# EasyEDA schematic SCH_280049主控制板.json
TITLE: Sheet_1; REV: 1.0; Date: 2020-03-19; Sheet: 1/1; Drawn By: paking_zhang; Company: Your Company
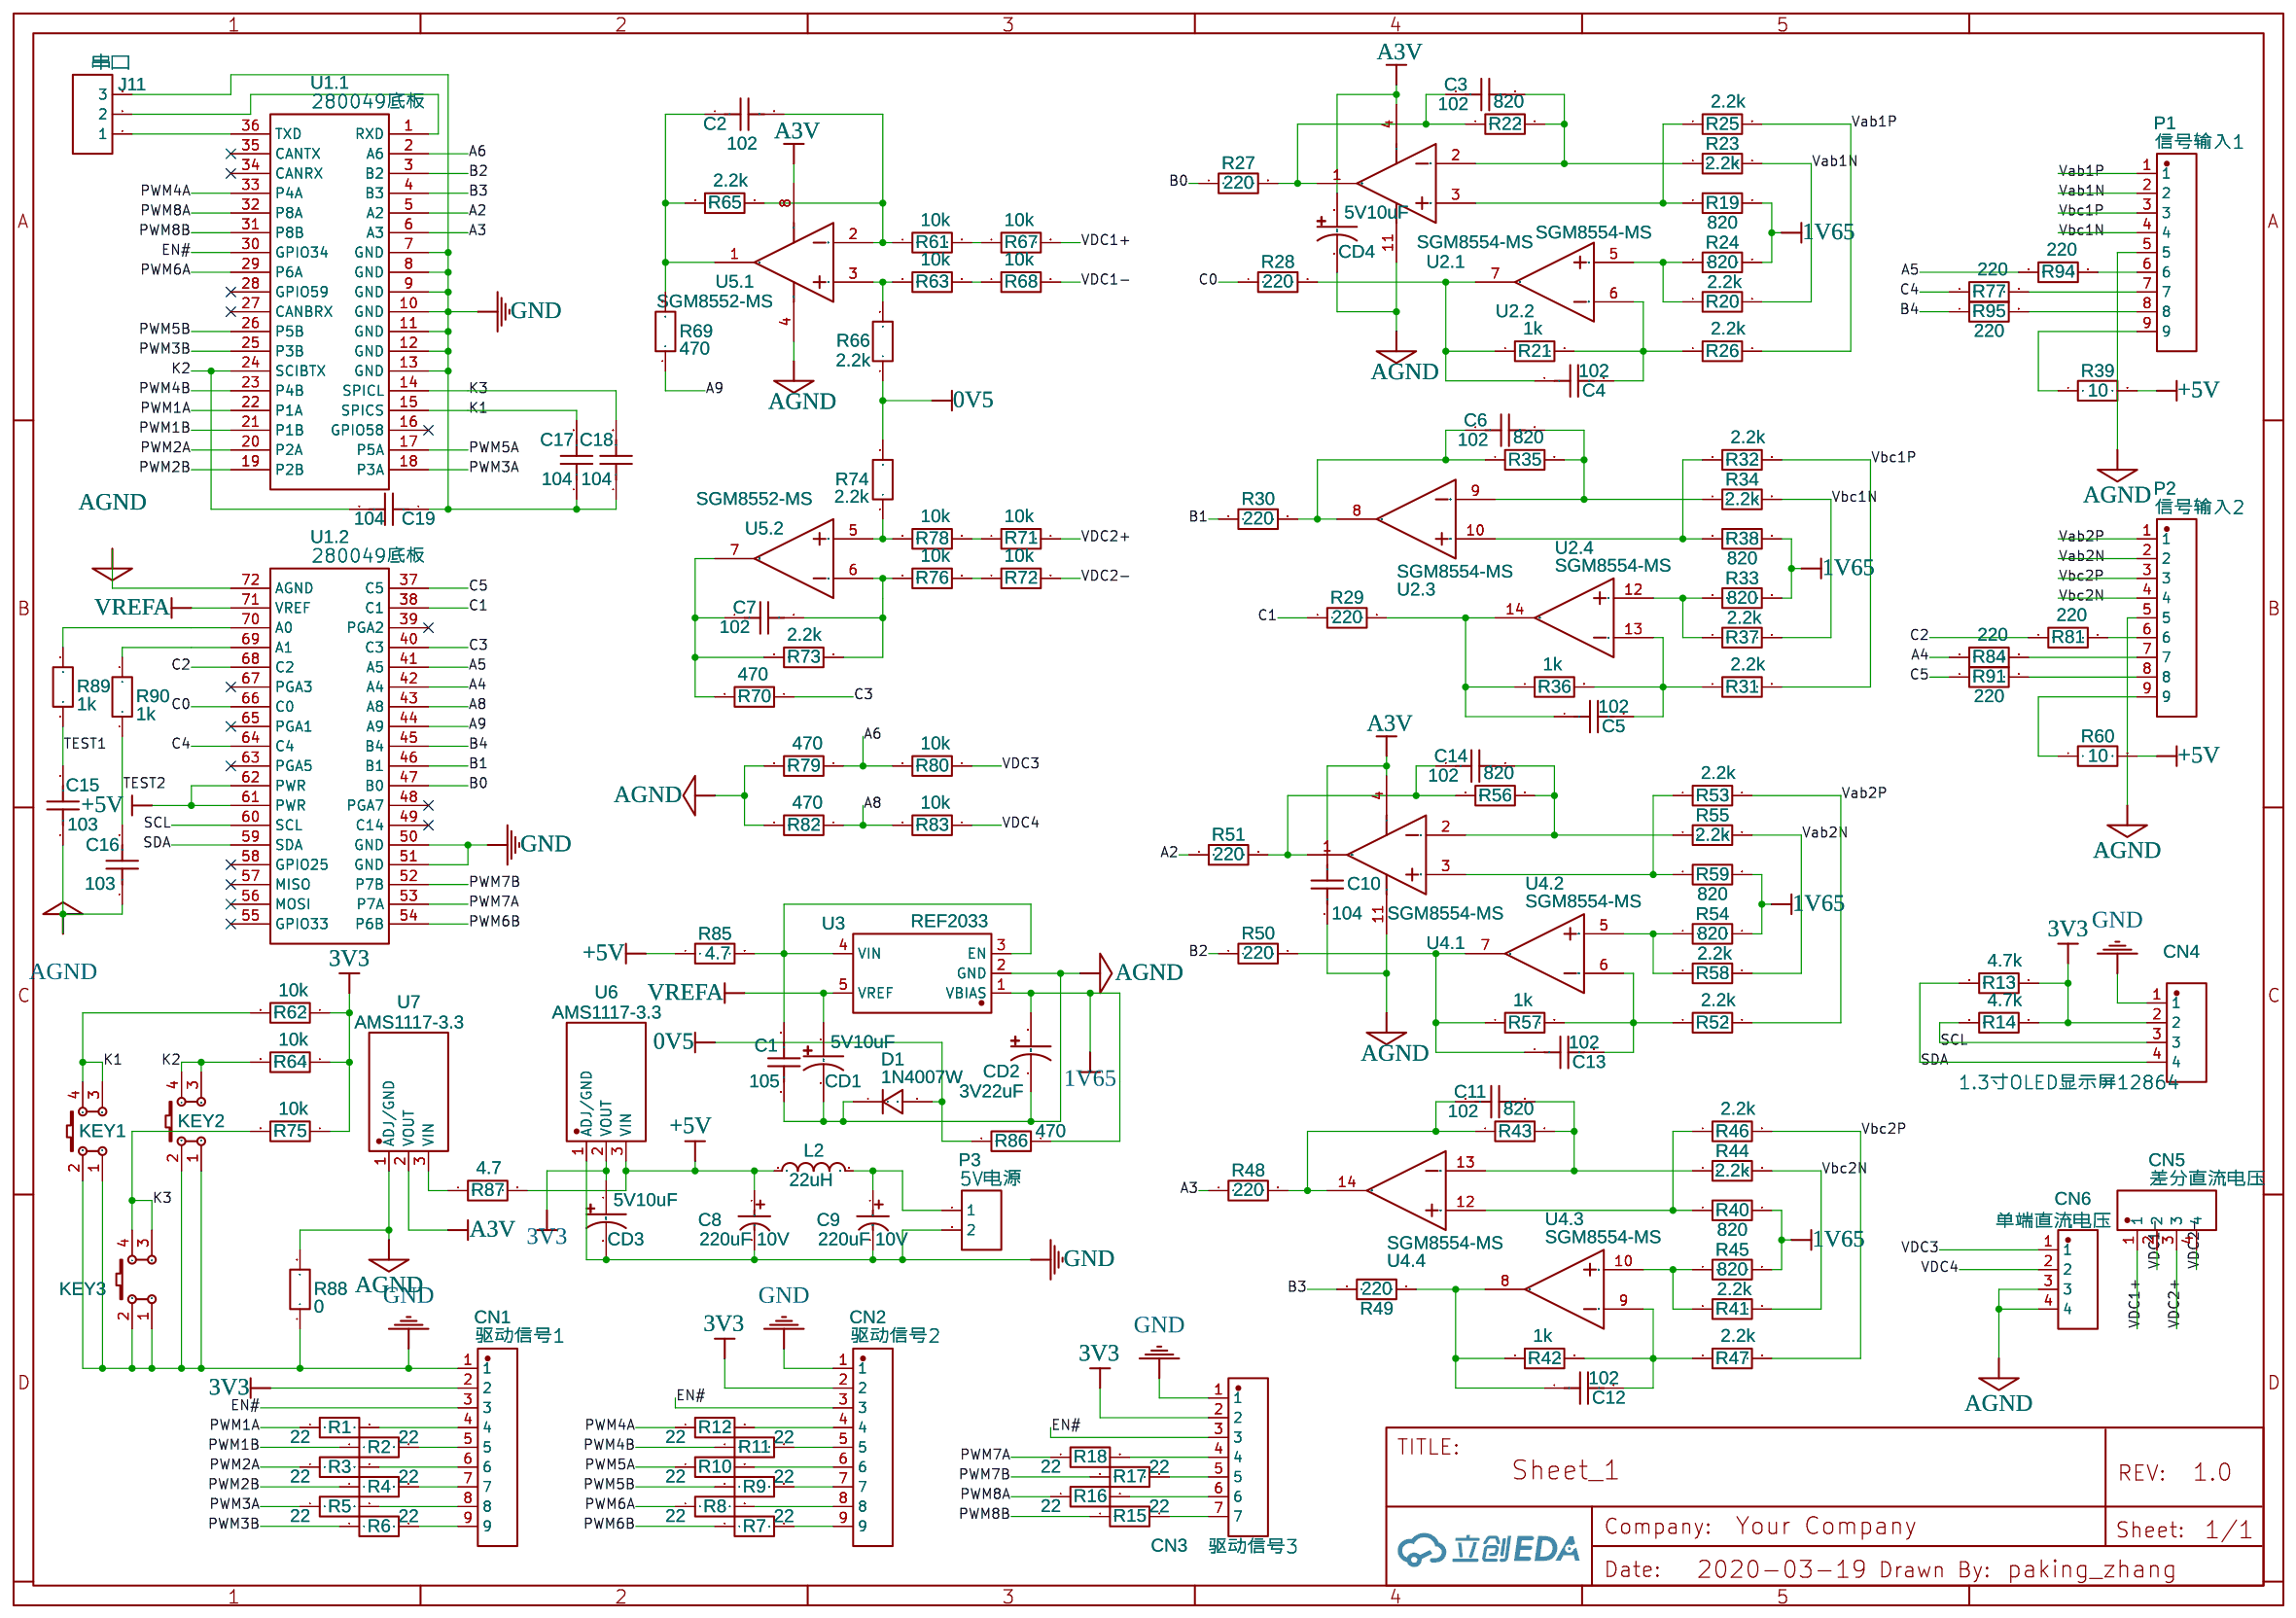
[diagram p0: schematic sheet]

## Parts
C1  105  [C0805]
C2  102  [C0805]
C3  102  [C0805]
C4  102  [C0805]
C5  102  [C0805]
C6  102  [C0805]
C7  102  [C0805]
C8  220uF 10V  [CAP-SMD_BD6.3-L6.6-W6.6-LS7.2-FD]
C9  220uF 10V  [CAP-SMD_BD6.3-L6.6-W6.6-LS7.2-FD]
C10  104  [C0805]
C11  102  [C0805]
C12  102  [C0805]
C13  102  [C0805]
C14  102  [C0805]
C15  103  [C0805]
C16  103  [C0805]
C17  104  [C0805]
C18  104  [C0805]
C19  104  [C0805]
CD1  5V10uF  [CAP-SMD_L3.2-W1.6]
CD2  3V22uF  [CAP-SMD_L3.2-W1.6]
CD3  5V10uF  [CAP-SMD_L3.2-W1.6]
CD4  5V10uF  [CAP-SMD_L3.2-W1.6]
CN1  驱动信号1  [CONN-TH_9P-P2.50_BX-XH2.54-9PZZ]
CN2  驱动信号2  [CONN-TH_9P-P2.50_BX-XH2.54-9PZZ]
CN3  驱动信号3  [CONN-TH_XH2.54-7P]
CN4  1.3寸OLED显示屏12864  [OLED-TH12864]
CN5  差分直流电压  [CONN-TH_XH2.54-4]
CN6  单端直流电压  [CONN-TH_XH2.54-4]
D1  1N4007W  [SOD-123_L2.8-W1.8-LS3.7-RD]
J11  串口  [HDR-M-2.54_1X3]
KEY1  K4-6×6_TH  [KEY-TH_4P-L6.0-W6.0-P4.50-LS6.5]
KEY2  K4-6×6_TH  [KEY-TH_4P-L6.0-W6.0-P4.50-LS6.5]
KEY3  K4-6×6_TH  [KEY-TH_4P-L6.0-W6.0-P4.50-LS6.5]
L2  22uH  [IND-SMD_L4.0-W4.0]
P1  信号输入1  [CONN-TH_XH2.54-9A]
P2  信号输入2  [CONN-TH_XH2.54-9A]
P3  5V电源  [CONN-TH_2P-P5.08]
R1  22  [R0805]
R2  22  [R0805]
R3  22  [R0805]
R4  22  [R0805]
R5  22  [R0805]
R6  22  [R0805]
R7  22  [R0805]
R8  22  [R0805]
R9  22  [R0805]
R10  22  [R_AXIAL-0.5]
R11  22  [R0805]
R12  22  [R0805]
R13  4.7k  [R0805]
R14  4.7k  [R0805]
R15  22  [R_AXIAL-0.4]
R16  22  [R_AXIAL-0.4]
R17  22  [R0805]
R18  22  [R0805]
R19  820  [R0805]
R20  2.2k  [R0805]
R21  1k  [R0805]
R22  820  [R0805]
R23  2.2k  [R0805]
R24  820  [R0805]
R25  2.2k  [R0805]
R26  2.2k  [R0805]
R27  220  [R_AXIAL-0.4]
R28  220  [R_AXIAL-0.4]
R29  220  [R_AXIAL-0.4]
R30  220  [R_AXIAL-0.4]
R31  2.2k  [R_AXIAL-0.4]
R32  2.2k  [R_AXIAL-0.4]
R33  820  [R0805]
R34  2.2k  [R_AXIAL-0.4]
R35  820  [R0805]
R36  1k  [R0805]
R37  2.2k  [R_AXIAL-0.4]
R38  820  [R0805]
R39  10  [R0805]
R40  820  [R0805]
R41  2.2k  [R0805]
R42  1k  [R0805]
R43  820  [R0805]
R44  2.2k  [R0805]
R45  820  [R0805]
R46  2.2k  [R0805]
R47  2.2k  [R0805]
R48  220  [R0805]
R49  220  [R0805]
R50  220  [R0805]
R51  220  [R0805]
R52  2.2k  [R0805]
R53  2.2k  [R0805]
R54  820  [R0805]
R55  2.2k  [R0805]
R56  820  [R0805]
R57  1k  [R0805]
R58  2.2k  [R0805]
R59  820  [R0805]
R60  10  [R0805]
R61  10k  [R0805]
R62  10k  [R0805]
R63  10k  [R0805]
R64  10k  [R0805]
R65  2.2k  [R0805]
R66  2.2k  [R0805]
R67  10k  [R0805]
R68  10k  [R0805]
R69  470  [R0805]
R70  470  [R0805]
R71  10k  [R0805]
R72  10k  [R0805]
R73  2.2k  [R0805]
R74  2.2k  [R0805]
R75  10k  [R0805]
R76  10k  [R0805]
R77  220  [R_AXIAL-0.4]
R78  10k  [R0805]
R79  470  [R0805]
R80  10k  [R_AXIAL-0.4]
R81  220  [R0805]
R82  470  [R0805]
R83  10k  [R_AXIAL-0.4]
R84  220  [R0805]
R85  4.7  [R0805]
R86  470  [R0805]
R87  4.7  [R0805]
R88  0  [R0805]
R89  1k  [R_AXIAL-0.4]
R90  1k  [R_AXIAL-0.4]
R91  220  [R_AXIAL-0.4]
R94  220  [R_AXIAL-0.4]
R95  220  [R_AXIAL-0.4]
U1  280049底板  [280049底板]  (sections 1,2)
U2  SGM8554-MS  [SOIC-14_L8.6-W3.8-P1.27-LS6.0-BL]  (sections 1,2,3,4)
U3  REF2033  [SOT-23-5_L3.0-W1.7-P0.95-LS2.8-BL]
U4  SGM8554-MS  [SOIC-14_L8.6-W3.8-P1.27-LS6.0-BL]  (sections 1,2,3,4)
U5  SGM8552-MS  [SOIC-8_L5.0-W4.0-P1.27-LS6.1-BL]  (sections 1,2)
U6  AMS1117-3.3  [SOT-89-3_L4.5-W2.5-P1.50-LS4.2-BR]
U7  AMS1117-3.3  [SOT-89-3_L4.5-W2.5-P1.50-LS4.2-BR]

## Library data of the parts
C1 C2 C7 C10 C15 C16 = C_0805_US: Contributor: LCEDA_Lib
C3-C6 C11-C14 = C_0603_US: Contributor: LCEDA_Lib
C8 C9 = 固态电容220UF/10V6.3*5.4: Contributor: LCSC; Supplier: LCSC; Supplier Part: C9900001736; Manufacturer Part: 固态电容220uF/10V6.3*5.4; JLCPCB Part Class: Extended Part; Manufacturer: null
C17-C19 = C_RAD-0.2_US: Contributor: LCEDA_Lib
CD1-CD4 = 5V10UF钽电容-3528: Contributor: LCSC; Supplier: LCSC; Supplier Part: C9900010526; Manufacturer: null; Manufacturer Part: 5v10uf钽电容-3528
CN1 CN2 = BX-XH2.54-9PZZ: Supplier: LCSC; Supplier Part: C18077840; Manufacturer: Bossie(博锡); Contributor: lcsc; JLCPCB Part Class: Extended Part
CN3 = XH2.54-7P 直插: Contributor: LCSC; Supplier: LCSC; Supplier Part: C9900000729; Manufacturer: null; JLCPCB Part Class: Extended Part
CN4 = 1.3寸OLED显示屏12864: Contributor: lcsc; Supplier: LCSC; Supplier Part: C9900014198; Manufacturer: null; JLCPCB Part Class: Extended Part
CN5 CN6 = XH2.54-4PIN: Contributor: lcsc; Supplier: LCSC; Supplier Part: C9900014913; Manufacturer: null; JLCPCB Part Class: Extended Part
D1 = 1N4007W: Supplier: LCSC; Supplier Part: C328592; Manufacturer: BLUE ROCKET; Contributor: LCEDA_Lib
J11 = HDR-M-2.54_1x3: Supplier Part: C180248; Supplier: LCSC; Contributor: LCEDA_Lib
KEY1-KEY3 = K4-6×6_TH: Supplier: LCSC; Supplier Part: C136684; Manufacturer: 韩国韩荣; Manufacturer Part: K2-1102DP-E4SW-04; Contributor: LCEDA_Lib
L2 = ASPIAIG-S4035-2R2M-T: Supplier: LCSC; Supplier Part: C7217583; Manufacturer: ABRACON; Contributor: lcsc; JLCPCB Part Class: Extended Part
P1 P2 = BX-XH2.54-9PWZ: Supplier: LCSC; Supplier Part: C18077849; Manufacturer: Bossie(博锡); Contributor: lcsc; JLCPCB Part Class: Extended Part
P3 = CONN-TH_2P-P5.08: Supplier: LCSC; Contributor: LCEDA_Lib
R1-R91 R94 R95 = R_0805_EU: Contributor: LCEDA_Lib
U1 = 28069底板: Contributor: Qu♂; subpart_no: 1
U2 U4 = SGM8554-MS: Supplier: LCSC; Supplier Part: C22462540; Manufacturer: null; JLCPCB Part Class: Extended Part; subpart_no: 1
U3 = REF2033AIDDCR: Contributor: LCSC; Supplier: LCSC; Supplier Part: C440747; Manufacturer: TI(德州仪器); JLCPCB Part Class: Extended Part
U5 = SGM8552-MS: Supplier: LCSC; Supplier Part: C22462535; Manufacturer: null; JLCPCB Part Class: Extended Part; subpart_no: 1
U6 U7 = AMS1117-5.0V: Supplier: LCSC; Supplier Part: C7473143; Manufacturer: MSKSEMI(美森科); Contributor: lcsc; JLCPCB Part Class: Extended Part

## Nets
0V5: D1.2 R66.1 R74.2 R86.2
1V65: CD2.1 R19.2 R24.2 R33.2 R38.2 R40.2 R45.2 R54.2 R59.2 R86.1 U3.1(VBIAS)
3V3: CD3.1 CN1.2 CN2.2 CN3.2 CN4.2 R13.1 R14.1 R62.1 R64.1 R75.1 U6.2(VOUT)
+5V: C8.1 L2.1 R39.2 R60.2 R85.1 R87.2 U1.61(PWR) U1.62(PWR) U6.3(VIN)
A3V: C10.2 CD4.1 U2.4(V+) U4.4(V+) U5.8(V+) U7.2(VOUT)
AGND: C1.1 C10.1 C15.1 C16.1 CD1.2 CD2.2 CD4.2 CN6.3 CN6.4 D1.1 P1.5 P2.5 R79.2 R82.2 R88.2 U1.72(AGND) U2.11(V-) U3.2(GND) U4.11(V-) U5.4(GND) U7.1(ADJ/GND)
GND: C8.2 C9.2 C17.1 C18.1 C19.1 CD3.2 CN1.1 CN2.1 CN3.1 CN4.1 J11.3 KEY1.1 KEY1.2 KEY2.1 KEY2.2 KEY3.1 KEY3.2 P3.2 R88.1 U1.7(GND) U1.8(GND) U1.9(GND) U1.10(GND) U1.11(GND) U1.12(GND) U1.13(GND) U1.50(GND) U1.51(GND) U6.1(ADJ/GND)
A2: R51.1 U1.5(A2)
A3: R48.1 U1.6(A3)
A4: R84.1 U1.42(A4)
A5: R94.1 U1.41(A5)
A6: R79.1 R80.2 U1.2(A6)
A8: R82.1 R83.2 U1.43(A8)
A9: R69.1 U1.44(A9)
B0: R27.1 U1.47(B0)
B1: R30.1 U1.46(B1)
B2: R50.1 U1.3(B2)
B3: R49.1 U1.4(B3)
B4: R95.1 U1.45(B4)
C0: R28.1 U1.66(C0)
C1: R29.1 U1.38(C1)
C2: R81.1 U1.68(C2)
C3: R70.1 U1.40(C3)
C4: R77.1 U1.64(C4)
C5: R91.1 U1.37(C5)
EN#: CN1.3 CN2.3 CN3.3 U1.30(GPIO34)
K1: C17.2 KEY1.3 KEY1.4 R62.2 U1.15(SPICS)
K2: C19.2 KEY2.3 KEY2.4 R64.2 U1.24(SCIBTX)
K3: C18.2 KEY3.3 KEY3.4 R75.2 U1.14(SPICL)
PWM1A: R1.1 U1.22(P1A)
PWM1B: R2.1 U1.21(P1B)
PWM2A: R3.1 U1.20(P2A)
PWM2B: R4.1 U1.19(P2B)
PWM3A: R5.1 U1.18(P3A)
PWM3B: R6.1 U1.25(P3B)
PWM4A: R12.1 U1.33(P4A)
PWM4B: R11.1 U1.23(P4B)
PWM5A: R10.1 U1.17(P5A)
PWM5B: R9.1 U1.26(P5B)
PWM6A: R8.1 U1.29(P6A)
PWM6B: R7.1 U1.54(P6B)
PWM7A: R18.1 U1.53(P7A)
PWM7B: R17.1 U1.52(P7B)
PWM8A: R16.1 U1.32(P8A)
PWM8B: R15.1 U1.31(P8B)
SCL: CN4.3 R14.2 U1.60(SCL)
SDA: CN4.4 R13.2 U1.59(SDA)
TEST1: C15.2 R89.1
TEST2: C16.2 R90.1
Vab1N: P1.2 R20.2 R23.2
Vab1P: P1.1 R25.2 R26.2
Vab2N: P2.2 R55.2 R58.2
Vab2P: P2.1 R52.2 R53.2
Vbc1N: P1.4 R34.2 R37.2
Vbc1P: P1.3 R31.2 R32.2
Vbc2N: P2.4 R41.2 R44.2
Vbc2P: P2.3 R46.2 R47.2
VDC1+: CN5.1 R67.2
VDC1-: CN5.2 R68.2
VDC2+: CN5.3 R72.2
VDC2-: CN5.4 R71.2
VDC3: CN6.1 R80.1
VDC4: CN6.2 R83.1
VREFA: CD1.1 U1.71(VREF) U3.5(VREF)
Net-(C1-2): C1.2 R85.2 U3.3(EN) U3.4(VIN)
Net-(C2-1): C2.1 R65.1 R69.2 U5.1(OUTA)
Net-(C2-2): C2.2 R61.1 R65.2 U5.2(INA-)
Net-(C3-1): C3.1 R22.1 R27.2 U2.1(1OUT)
Net-(C3-2): C3.2 R22.2 R23.1 U2.2(1IN−)
Net-(C4-1): C4.1 R21.1 R28.2 U2.7(2OUT)
Net-(C4-2): C4.2 R21.2 R26.1 U2.6(2IN−)
Net-(C5-1): C5.1 R29.2 R36.1 U2.14(4OUT)
Net-(C5-2): C5.2 R31.1 R36.2 U2.13(4IN−)
Net-(C6-1): C6.1 R30.2 R35.1 U2.8(3OUT)
Net-(C6-2): C6.2 R34.1 R35.2 U2.9(3IN−)
Net-(C7-1): C7.1 R70.2 R73.2 U5.7(OUTB)
Net-(C7-2): C7.2 R73.1 R76.1 U5.6(INB-)
Net-(C9-1): C9.1 L2.2 P3.1
Net-(C11-1): C11.1 R43.1 R48.2 U4.14(4OUT)
Net-(C11-2): C11.2 R43.2 R44.1 U4.13(4IN−)
Net-(C12-1): C12.1 R42.1 R49.2 U4.8(3OUT)
Net-(C12-2): C12.2 R42.2 R47.1 U4.9(3IN−)
Net-(C13-1): C13.1 R50.2 R57.1 U4.7(2OUT)
Net-(C13-2): C13.2 R52.1 R57.2 U4.6(2IN−)
Net-(C14-1): C14.1 R51.2 R56.1 U4.1(1OUT)
Net-(C14-2): C14.2 R55.1 R56.2 U4.2(1IN−)
Net-(CN1-4): CN1.4 R1.2
Net-(CN1-5): CN1.5 R2.2
Net-(CN1-6): CN1.6 R3.2
Net-(CN1-7): CN1.7 R4.2
Net-(CN1-8): CN1.8 R5.2
Net-(CN1-9): CN1.9 R6.2
Net-(CN2-4): CN2.4 R12.2
Net-(CN2-5): CN2.5 R11.2
Net-(CN2-6): CN2.6 R10.2
Net-(CN2-7): CN2.7 R9.2
Net-(CN2-8): CN2.8 R8.2
Net-(CN2-9): CN2.9 R7.2
Net-(CN3-4): CN3.4 R18.2
Net-(CN3-5): CN3.5 R17.2
Net-(CN3-6): CN3.6 R16.2
Net-(CN3-7): CN3.7 R15.2
Net-(J11-1): J11.1 U1.36(TXD)
Net-(J11-2): J11.2 U1.1(RXD)
Net-(P1-6): P1.6 R94.2
Net-(P1-7): P1.7 R77.2
Net-(P1-8): P1.8 R95.2
Net-(P1-9): P1.9 R39.1
Net-(P2-6): P2.6 R81.2
Net-(P2-7): P2.7 R84.2
Net-(P2-8): P2.8 R91.2
Net-(P2-9): P2.9 R60.1
Net-(R19-1): R19.1 R25.1 U2.3(1IN+)
Net-(R20-1): R20.1 R24.1 U2.5(2IN+)
Net-(R32-1): R32.1 R38.1 U2.10(3IN+)
Net-(R33-1): R33.1 R37.1 U2.12(4IN+)
Net-(R40-1): R40.1 R46.1 U4.12(4IN+)
Net-(R41-1): R41.1 R45.1 U4.10(3IN+)
Net-(R53-1): R53.1 R59.1 U4.3(1IN+)
Net-(R54-1): R54.1 R58.1 U4.5(2IN+)
Net-(R61-2): R61.2 R67.1
Net-(R63-1): R63.1 R66.2 U5.3(INA+)
Net-(R63-2): R63.2 R68.1
Net-(R71-1): R71.1 R76.2
Net-(R72-1): R72.1 R78.2
Net-(R74-1): R74.1 R78.1 U5.5(INB+)
Net-(R87-1): R87.1 U7.3(VIN)
Net-(R89-2): R89.2 U1.70(A0)
Net-(R90-2): R90.2 U1.69(A1)

Not connected (* = marked no-connect by the designer): U1 16(GPIO58)* 27(CANBRX)* 28(GPIO59)* 34(CANRX)* 35(CANTX)* 39(PGA2)* 48(PGA7)* 49(C14)* 55(GPIO33)* 56(MOSI)* 57(MISO)* 58(GPIO25)* 63(PGA5)* 65(PGA1)* 67(PGA3)*
